# Altium schematic sheet driver_display.SchDoc
size A4
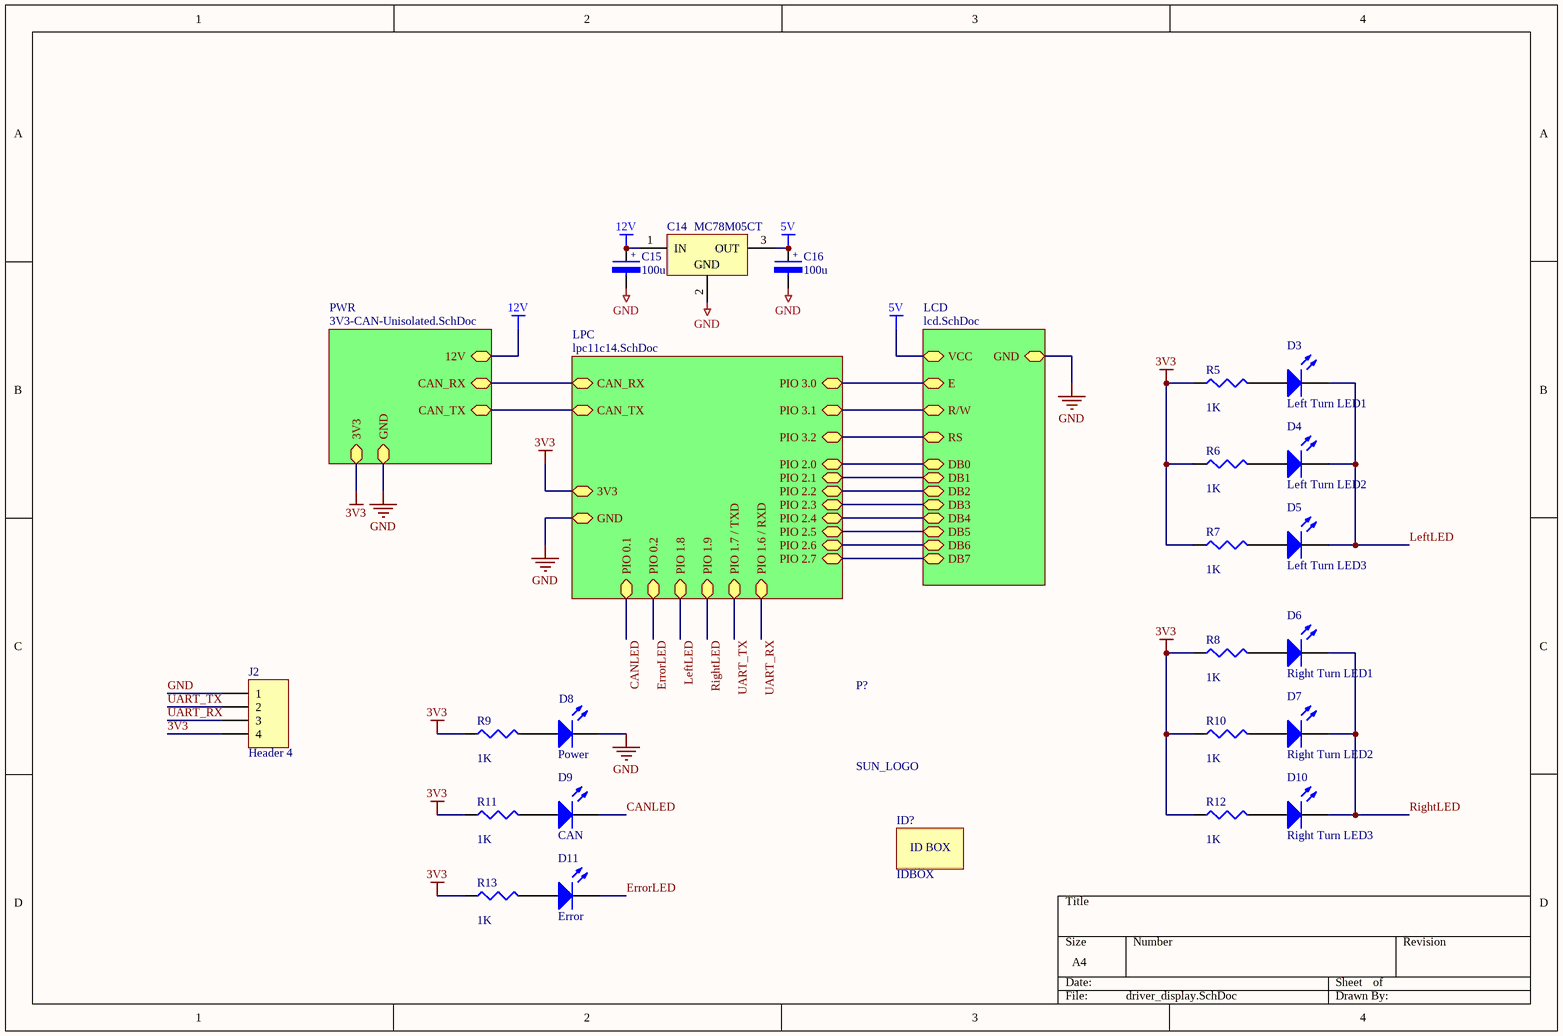
[diagram p0: driver_display.SchDoc]

## Parts
C14  MC78M05CT  [7805]
C15  100u  [RAD-0.1]
C16  100u  [RAD-0.1]
D3  Left Turn LED1  [0805LED12]
D4  Left Turn LED2  [0805LED12]
D5  Left Turn LED3  [0805LED12]
D6  Right Turn LED1  [0805LED12]
D7  Right Turn LED2  [0805LED12]
D8  Power  [0805LED12]
D9  CAN  [0805LED12]
D10  Right Turn LED3  [0805LED12]
D11  Error  [0805LED12]
ID?  IDBOX  [IDBOX]
J2  Header 4  [HDR1X4]
P?  SUN_LOGO  [SUNSWIFTLOGO]
R5  value 1K  [0603]  (hidden comment: Left Turn 1)
R6  value 1K  [0603]  (hidden comment: Left Turn 2)
R7  value 1K  [0603]  (hidden comment: Left Turn 3)
R8  value 1K  [0603]  (hidden comment: Res3)
R9  value 1K  [0603]  (hidden comment: Res3)
R10  value 1K  [0603]  (hidden comment: Res3)
R11  value 1K  [0603]  (hidden comment: Res3)
R12  value 1K  [0603]  (hidden comment: Res3)
R13  value 1K  [0603]  (hidden comment: Res3)

## Sub-sheets
LCD = lcd.SchDoc: DB1, E, R/W, RS, DB0, DB2, DB3, DB4, DB5, DB6, DB7, VCC, GND
LPC = lpc11c14.SchDoc: CAN_RX, CAN_TX, PIO 3.0, PIO 2.5, PIO 2.3, PIO 2.1, PIO 3.2, PIO 3.1, PIO 2.7, PIO 2.4, PIO 2.6, PIO 2.0, PIO 2.2, 3V3, GND, PIO 0.1, PIO 0.2, PIO 1.8, PIO 1.9, PIO 1.7 / TXD, PIO 1.6 / RXD
PWR = 3V3-CAN-Unisolated.SchDoc: GND, CAN_RX, CAN_TX, 3V3, 12V

## Nets
3V3: J2.4 R5.1 R6.1 R7.1 R8.1 R9.1 R10.1 R11.1 R12.1 R13.1 ; sheet LPC/3V3, sheet PWR/3V3
5V: C14.3(OUT) C16.1 ; sheet LCD/VCC
12V: C14.1(IN) C15.1 ; sheet PWR/12V
GND: C14.2(GND) C15.2 C16.2 D8.2(K) J2.1 ; sheet LPC/GND, sheet PWR/GND, sheet LCD/GND
CANLED: D9.2(K) ; sheet LPC/PIO 0.1
ErrorLED: D11.2(K) ; sheet LPC/PIO 0.2
LeftLED: D3.2(K) D4.2(K) D5.2(K) ; sheet LPC/PIO 1.8
RightLED: D6.2(K) D7.2(K) D10.2(K) ; sheet LPC/PIO 1.9
UART_RX: J2.3 ; sheet LPC/PIO 1.6 / RXD
UART_TX: J2.2 ; sheet LPC/PIO 1.7 / TXD
NetD3_1: D3.1(A) R5.2
NetD4_1: D4.1(A) R6.2
NetD5_1: D5.1(A) R7.2
NetD6_1: D6.1(A) R8.2
NetD7_1: D7.1(A) R10.2
NetD8_1: D8.1(A) R9.2
NetD9_1: D9.1(A) R11.2
NetD10_1: D10.1(A) R12.2
NetD11_1: D11.1(A) R13.2
(unnamed): sheet LPC/CAN_RX, sheet PWR/CAN_RX
(unnamed): sheet LPC/CAN_TX, sheet PWR/CAN_TX
(unnamed): sheet LPC/PIO 3.0, sheet LCD/E
(unnamed): sheet LPC/PIO 2.5, sheet LCD/DB5
(unnamed): sheet LPC/PIO 2.3, sheet LCD/DB3
(unnamed): sheet LPC/PIO 2.1, sheet LCD/DB1
(unnamed): sheet LPC/PIO 3.2, sheet LCD/RS
(unnamed): sheet LPC/PIO 3.1, sheet LCD/R/W
(unnamed): sheet LPC/PIO 2.7, sheet LCD/DB7
(unnamed): sheet LPC/PIO 2.4, sheet LCD/DB4
(unnamed): sheet LPC/PIO 2.6, sheet LCD/DB6
(unnamed): sheet LPC/PIO 2.0, sheet LCD/DB0
(unnamed): sheet LPC/PIO 2.2, sheet LCD/DB2

## Notes on the sheet
- (in symbol CAP-POL) +
- (in symbol IDBOX) ID BOX

## Library data of the parts
C14 = MC78M05CT: 3-Terminal Medium-Current Positive Fixed Voltage Regulator; Note: Pin 2 is electrically connected to TAB; Code - JEDEC: TO-262-AA; Published: 17-Jul-2002; Datasheet: Linear and Interface Integrated Circuits, DL128 Rev2 (1988); Package Reference: 221A-04; Publisher: Altium Limited
C15 C16 = CAP-POL: Capacitor
D3-D11 = LED2: Typical RED, GREEN, YELLOW, AMBER GaAs LED; Published: 8-Jun-2000; LatestRevisionDate: 17-Jul-2002; LatestRevisionNote: Re-released for DXP Platform.; PackageVersion: Feb-2002; Publisher: Altium Limited; PackageDescription: SM LED; 2 Flat Leads
  D8 D9 D11: PackageReference: 3.2X1.6X1.1
J2 = Header 4: Header, 4-Pin; LatestRevisionDate: 17-Jul-2002; LatestRevisionNote: Re-released for DXP Platform.; Publisher: Altium Limited
R5-R13 = Res3: Resistor; Published: 8-Jun-2000; LatestRevisionDate: 29-May-2009; LatestRevisionNote: IPC-7351 Footprint Added.; PackageReference: J1-0603; Publisher: Altium Limited; PackageDescription: Chip Resistor